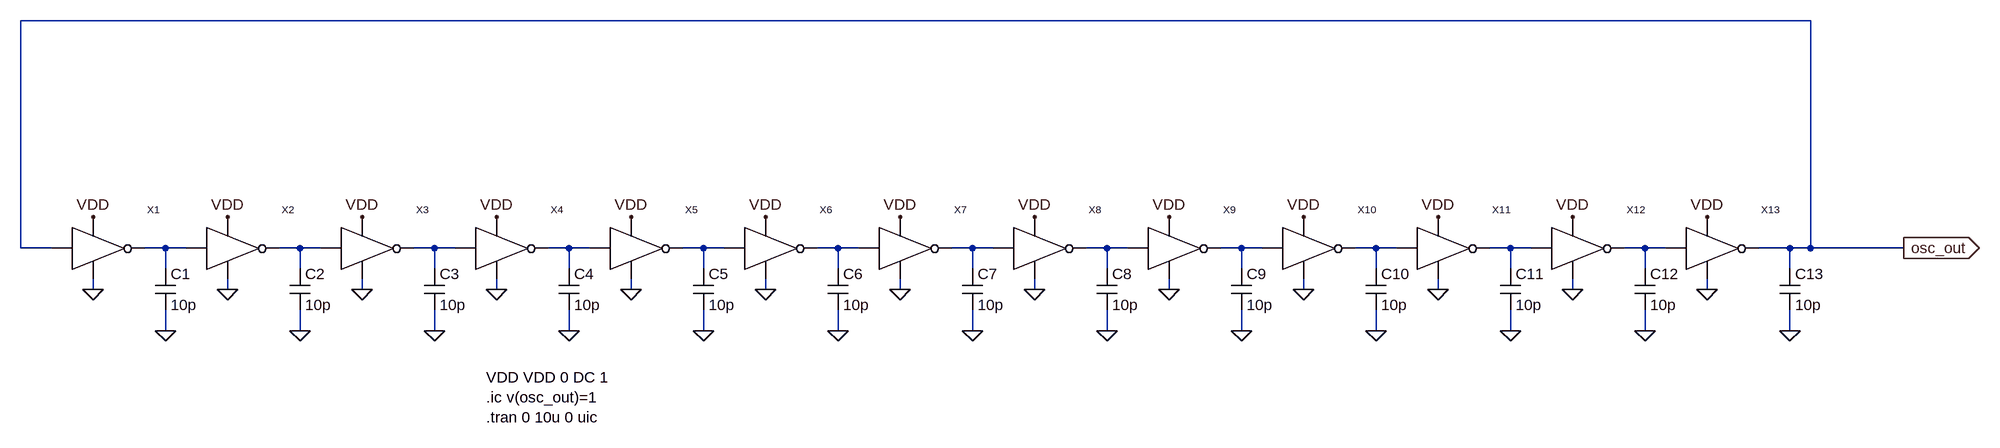
[diagram p0: schematic ringosc.asc]
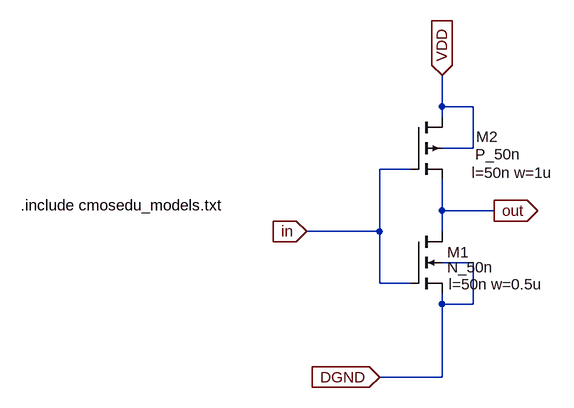
[diagram p1: sub-circuit inverter.asc]
ringosc.asc, the LTspice schematic file:
Version 4
SHEET 1 3064 680
WIRE 2768 -176 0 -176
WIRE 0 176 0 -176
WIRE 48 176 0 176
WIRE 224 176 192 176
WIRE 256 176 224 176
WIRE 432 176 400 176
WIRE 464 176 432 176
WIRE 640 176 608 176
WIRE 672 176 640 176
WIRE 848 176 816 176
WIRE 880 176 848 176
WIRE 1056 176 1024 176
WIRE 1088 176 1056 176
WIRE 1264 176 1232 176
WIRE 1296 176 1264 176
WIRE 1472 176 1440 176
WIRE 1504 176 1472 176
WIRE 1680 176 1648 176
WIRE 1712 176 1680 176
WIRE 1888 176 1856 176
WIRE 1920 176 1888 176
WIRE 2096 176 2064 176
WIRE 2128 176 2096 176
WIRE 2304 176 2272 176
WIRE 2336 176 2304 176
WIRE 2512 176 2480 176
WIRE 2544 176 2512 176
WIRE 2736 176 2688 176
WIRE 2768 176 2768 -176
WIRE 2768 176 2736 176
WIRE 2912 176 2768 176
WIRE 224 208 224 176
WIRE 432 208 432 176
WIRE 640 208 640 176
WIRE 848 208 848 176
WIRE 1056 208 1056 176
WIRE 1264 208 1264 176
WIRE 1472 208 1472 176
WIRE 1680 208 1680 176
WIRE 1888 208 1888 176
WIRE 2096 208 2096 176
WIRE 2304 208 2304 176
WIRE 2512 208 2512 176
WIRE 2736 208 2736 176
WIRE 112 240 112 224
WIRE 320 240 320 224
WIRE 528 240 528 224
WIRE 736 240 736 224
WIRE 944 240 944 224
WIRE 1152 240 1152 224
WIRE 1360 240 1360 224
WIRE 1568 240 1568 224
WIRE 1776 240 1776 224
WIRE 1984 240 1984 224
WIRE 2192 240 2192 224
WIRE 2400 240 2400 224
WIRE 2608 240 2608 224
WIRE 224 304 224 272
WIRE 432 304 432 272
WIRE 640 304 640 272
WIRE 848 304 848 272
WIRE 1056 304 1056 272
WIRE 1264 304 1264 272
WIRE 1472 304 1472 272
WIRE 1680 304 1680 272
WIRE 1888 304 1888 272
WIRE 2096 304 2096 272
WIRE 2304 304 2304 272
WIRE 2512 304 2512 272
WIRE 2736 304 2736 272
FLAG 112 240 0
FLAG 112 128 VDD
FLAG 320 240 0
FLAG 320 128 VDD
FLAG 528 240 0
FLAG 528 128 VDD
FLAG 736 240 0
FLAG 736 128 VDD
FLAG 944 240 0
FLAG 944 128 VDD
FLAG 1152 240 0
FLAG 1152 128 VDD
FLAG 1360 240 0
FLAG 1360 128 VDD
FLAG 1568 240 0
FLAG 1568 128 VDD
FLAG 1776 240 0
FLAG 1776 128 VDD
FLAG 1984 240 0
FLAG 1984 128 VDD
FLAG 2192 240 0
FLAG 2192 128 VDD
FLAG 2400 240 0
FLAG 2400 128 VDD
FLAG 2608 240 0
FLAG 2608 128 VDD
FLAG 2912 176 osc_out
IOPIN 2912 176 Out
FLAG 2736 304 0
FLAG 2512 304 0
FLAG 2304 304 0
FLAG 2096 304 0
FLAG 1888 304 0
FLAG 1680 304 0
FLAG 1472 304 0
FLAG 1264 304 0
FLAG 1056 304 0
FLAG 848 304 0
FLAG 640 304 0
FLAG 432 304 0
FLAG 224 304 0
SYMBOL inverter 80 176 R0
SYMATTR InstName X1
SYMBOL inverter 288 176 R0
SYMATTR InstName X2
SYMBOL inverter 496 176 R0
SYMATTR InstName X3
SYMBOL inverter 704 176 R0
SYMATTR InstName X4
SYMBOL inverter 912 176 R0
SYMATTR InstName X5
SYMBOL inverter 1120 176 R0
SYMATTR InstName X6
SYMBOL inverter 1328 176 R0
SYMATTR InstName X7
SYMBOL inverter 1536 176 R0
SYMATTR InstName X8
SYMBOL inverter 1744 176 R0
SYMATTR InstName X9
SYMBOL inverter 1952 176 R0
SYMATTR InstName X10
SYMBOL inverter 2160 176 R0
SYMATTR InstName X11
SYMBOL inverter 2368 176 R0
SYMATTR InstName X12
SYMBOL inverter 2576 176 R0
SYMATTR InstName X13
SYMBOL cap 208 208 R0
SYMATTR InstName C1
SYMATTR Value 10p
SYMBOL cap 416 208 R0
SYMATTR InstName C2
SYMATTR Value 10p
SYMBOL cap 624 208 R0
SYMATTR InstName C3
SYMATTR Value 10p
SYMBOL cap 832 208 R0
SYMATTR InstName C4
SYMATTR Value 10p
SYMBOL cap 1040 208 R0
SYMATTR InstName C5
SYMATTR Value 10p
SYMBOL cap 1248 208 R0
SYMATTR InstName C6
SYMATTR Value 10p
SYMBOL cap 1456 208 R0
SYMATTR InstName C7
SYMATTR Value 10p
SYMBOL cap 1664 208 R0
SYMATTR InstName C8
SYMATTR Value 10p
SYMBOL cap 1872 208 R0
SYMATTR InstName C9
SYMATTR Value 10p
SYMBOL cap 2080 208 R0
SYMATTR InstName C10
SYMATTR Value 10p
SYMBOL cap 2288 208 R0
SYMATTR InstName C11
SYMATTR Value 10p
SYMBOL cap 2496 208 R0
SYMATTR InstName C12
SYMATTR Value 10p
SYMBOL cap 2720 208 R0
SYMATTR InstName C13
SYMATTR Value 10p
TEXT 720 376 Left 2 !VDD VDD 0 DC 1\n.ic v(osc_out)=1\n.tran 0 10u 0 uic

inverter.asc, the sub-circuit schematic file:
Version 4
SHEET 1 880 680
WIRE 176 -32 176 -80
WIRE 224 -32 176 -32
WIRE 176 -16 176 -32
WIRE 224 32 224 -32
WIRE 224 32 176 32
WIRE 128 64 80 64
WIRE 176 128 176 80
WIRE 256 128 176 128
WIRE 80 160 80 64
WIRE 80 160 -32 160
WIRE 176 160 176 128
WIRE 224 208 176 208
WIRE 80 240 80 160
WIRE 128 240 80 240
WIRE 176 272 176 256
WIRE 224 272 224 208
WIRE 224 272 176 272
WIRE 176 384 176 272
WIRE 176 384 80 384
FLAG 176 -80 VDD
IOPIN 176 -80 In
FLAG -32 160 in
IOPIN -32 160 In
FLAG 256 128 out
IOPIN 256 128 Out
FLAG 80 384 DGND
IOPIN 80 384 In
SYMBOL nmos4 128 160 R0
WINDOW 3 56 55 Left 2
WINDOW 123 58 81 Left 2
SYMATTR Value N_50n
SYMATTR Value2 l=50n w=0.5u
SYMATTR InstName M1
SYMBOL pmos4 128 -16 R0
WINDOW 0 101 30 Left 2
WINDOW 3 99 57 Left 2
WINDOW 123 94 86 Left 2
SYMATTR InstName M2
SYMATTR Value P_50n
SYMATTR Value2 l=50n w=1u
TEXT -472 120 Left 2 !.include cmosedu_models.txt

The netlist it stands for:
* ringosc.asc
XX1 osc_out N001 VDD 0 inverter
XX2 N001 N002 VDD 0 inverter
XX3 N002 N003 VDD 0 inverter
XX4 N003 N004 VDD 0 inverter
XX5 N004 N005 VDD 0 inverter
XX6 N005 N006 VDD 0 inverter
XX7 N006 N007 VDD 0 inverter
XX8 N007 N008 VDD 0 inverter
XX9 N008 N009 VDD 0 inverter
XX10 N009 N010 VDD 0 inverter
XX11 N010 N011 VDD 0 inverter
XX12 N011 N012 VDD 0 inverter
XX13 N012 osc_out VDD 0 inverter
C1 N001 0 10p
C2 N002 0 10p
C3 N003 0 10p
C4 N004 0 10p
C5 N005 0 10p
C6 N006 0 10p
C7 N007 0 10p
C8 N008 0 10p
C9 N009 0 10p
C10 N010 0 10p
C11 N011 0 10p
C12 N012 0 10p
C13 osc_out 0 10p

* block symbol definitions
.subckt inverter in out VDD DGND
M1 out in DGND DGND N_50n l=50n w=0.5u
M2 VDD in out VDD P_50n l=50n w=1u
.include cmosedu_models.txt
.ends inverter

.model NMOS NMOS
.model PMOS PMOS
.lib standard.mos
VDD VDD 0 DC 1
.ic v(osc_out)=1
.tran 0 10u 0 uic
.backanno
.end